# Altium schematic sheet Power.SchDoc
size A; SheetNumber: roneV11-Power; SheetTotal: 6
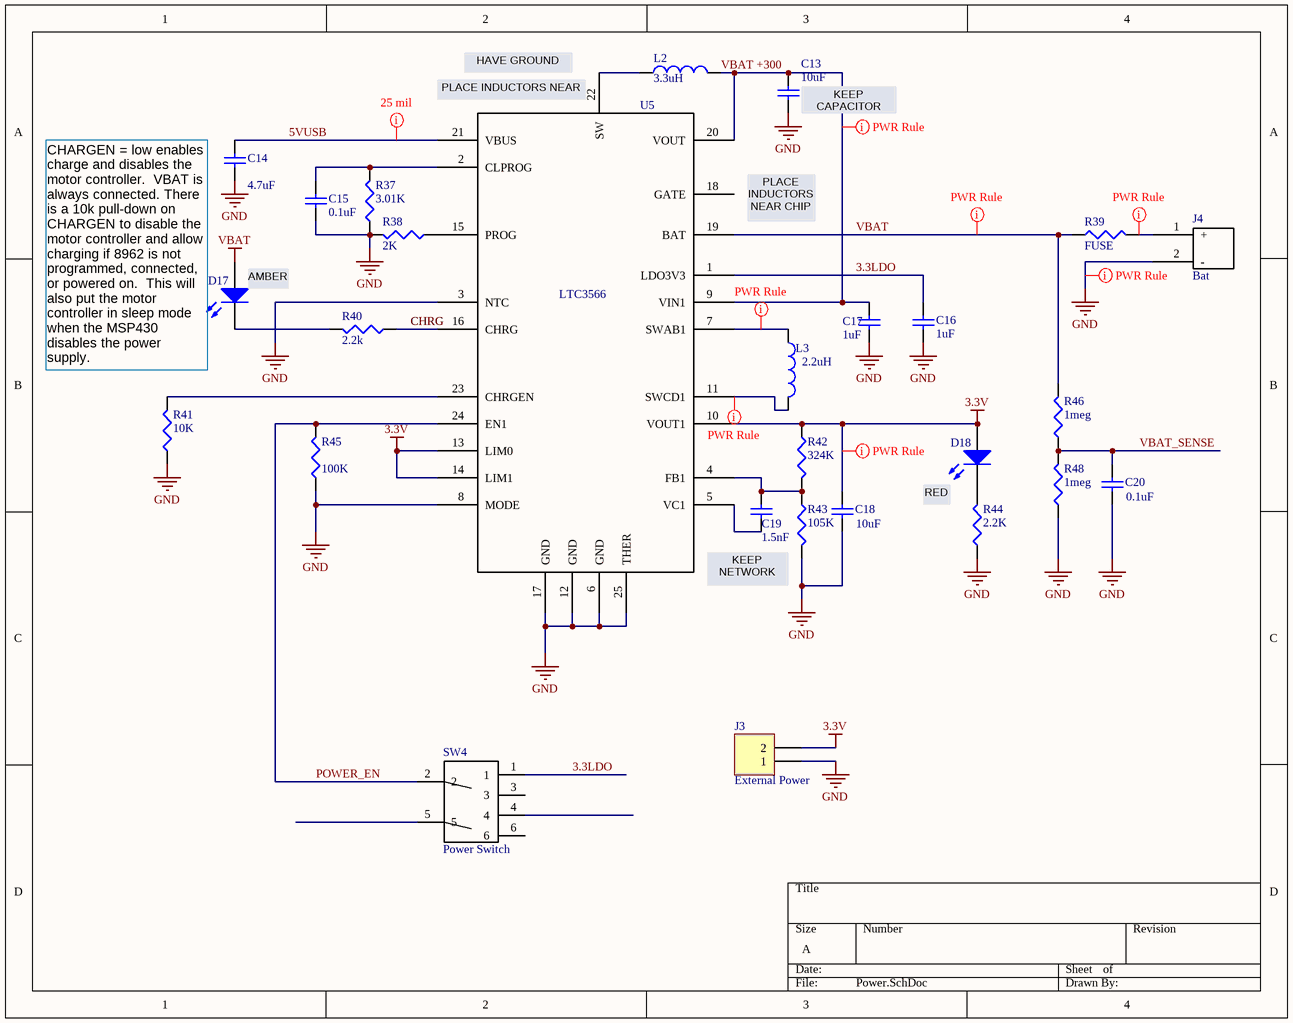
[diagram p0: Power.SchDoc]

## Parts
C13  value 10uF  [CAPC1608L]  (hidden comment: Cap)
C14  value 4.7uF  [CAPC1005L]  (hidden comment: Cap Semi)
C15  value 0.1uF  [CAPC1005L]  (hidden comment: Cap)
C16  value 1uF  [CAPC1608L]  (hidden comment: Cap)
C17  value 1uF  [CAPC1608L]  (hidden comment: Cap)
C18  value 10uF  [CAPC1608L]  (hidden comment: Cap)
C19  value 1.5nF  [CAPC1005L]  (hidden comment: Cap)
C20  value 0.1uF  [CAPC1608L]  (hidden comment: Cap)
D17  Charge  [2029]  (value not drawn)
D18  Power  [2029]  (value not drawn)
J3  External Power  [HDR1X2]
J4  Bat  [BatteryConnJST]
L2  3.3uH  [IndPow]
L3  2.2uH  [IndPow]
R37  value 3.01K  [J1-0603]  (hidden comment: Res3)
R38  value 2K  [J1-0603]  (hidden comment: Res3)
R39  value FUSE  [RESC3225L]  (hidden comment: Res3)
R40  value 2.2k  [J1-0603]  (hidden comment: Res3)
R41  value 10K  [J1-0603]  (hidden comment: Res3)
R42  value 324K  [J1-0603]  (hidden comment: Res3)
R43  value 105K  [J1-0603]  (hidden comment: Res3)
R44  value 2.2K  [J1-0603]  (hidden comment: Res3)
R45  value 100K  [J1-0603]  (hidden comment: Res3)
R46  value 1meg  [J1-0603]  (hidden comment: Res3)
R48  value 1meg  [J1-0603]  (hidden comment: Res3)
SW4  Power Switch  [DPDTSwitch]
U5  LTC3566  [QFN-24]

## Nets
3.3V: C18.2 D18.1(A) J3.2 R42.1 U5.10(VOUT1) U5.13(LIM0) U5.14(LIM1)
GND: C13.1 C14.1 C15.1 C16.2 C17.2 C18.1 C20.1 J3.1 J4.2(-) R37.1 R38.2 R41.1 R43.2 R44.1 R45.1 R48.1 U5.3(NTC) U5.6(GND) U5.8(MODE) U5.12(GND) U5.17(GND) U5.25(THER)
VBAT: D17.1(A) R39.1 R46.2 U5.19(BAT)
3.3LDO: C16.1 SW4.1 U5.1(LDO3V3)
5VUSB: C14.2 U5.21(VBUS)
CHRG: R40.1 U5.16(CHRG)
POWER_EN: R45.2 SW4.2 U5.24(EN1)
VBAT +300: C13.2 C17.1 L2.2 U5.9(VIN1) U5.20(VOUT)
VBAT_SENSE: C20.2 R46.1 R48.2
NetC15_2: C15.2 R37.2 U5.2(CLPROG)
NetC19_1: C19.1 R42.2 R43.1 U5.4(FB1)
NetC19_2: C19.2 U5.5(VC1)
NetD17_2: D17.2(K) R40.2
NetD18_2: D18.2(K) R44.2
NetJ4_1: J4.1(+) R39.2
NetL2_1: L2.1 U5.22(SW)
NetL3_1: L3.1 U5.7(SWAB1)
NetL3_2: L3.2 U5.11(SWCD1)
NetR38_1: R38.1 U5.15(PROG)
NetR41_2: R41.2 U5.23(CHRGEN)

Not connected (* = marked no-connect by the designer): SW4 3 4 5 6; U5 18(GATE)

## Layout directives
rule Width Constraint [Pref Width = 8mil    Min Width = 8mil    Max Width = 25mil]: 5VUSB
rule Width Constraint [Pref Width = 25mil    Min Width = 10mil    Max Width = 50mil]: 3.3V, GND, NetJ4_1, NetL3_1, NetL3_2, VBAT, VBAT +300

## Notes on the sheet
- (near U5) PLACE INDUCTORS NEAR CHIP
- (near U5) HAVE GROUND PLANE
- (near C13) KEEP CAPACITOR CLOSE TO CHIP
- PLACE INDUCTORS NEAR CHIP
- (near D17) AMBER
- CHARGEN = low enables charge and disables the motor controller.  VBAT is always connected. There is a 10k pull-down on CHARGEN to disable the motor controller and allow charging if 8962 is not programmed, connected, or powered on.  This will also put the motor controller in sleep mode when the MSP430 disables the power supply.
- CHRG
- RED
- KEEP NETWORK CLOSE TO CHIP

## Library data of the parts
C13 C15-C20 = Cap: Capacitor; Published: 8-Jun-2000; LatestRevisionDate: 17-Jul-2002; LatestRevisionNote: Re-released for DXP Platform.; PackageReference: RAD-0.3; Publisher: Altium Limited
C14 = Cap Semi: Capacitor (Semiconductor SIM Model); Published: 8-Jun-2000; LatestRevisionDate: 29-May-2009; LatestRevisionNote: IPC-7351 Footprint Added.; PackageReference: C1206; Publisher: Altium Limited; PackageDescription: Chip Capacitor
D17 D18 = LED2: Typical RED, GREEN, YELLOW, AMBER GaAs LED; Published: 8-Jun-2000; LatestRevisionDate: 17-Jul-2002; LatestRevisionNote: Re-released for DXP Platform.; PackageVersion: Feb-2002; PackageReference: 3.2X1.6X1.1; Publisher: Altium Limited
J3 = Header 2: Header, 2-Pin; LatestRevisionDate: 17-Jul-2002; LatestRevisionNote: Re-released for DXP Platform.; Publisher: Altium Limited
J4 = BatteryConnJST
L2 L3 = Inductor
  L2: Value: 3.3uH
  L3: Value: 2.2uH
R37-R46 R48 = Res3: Resistor; Published: 8-Jun-2000; LatestRevisionDate: 29-May-2009; LatestRevisionNote: IPC-7351 Footprint Added.; PackageReference: J1-0603; Publisher: Altium Limited; PackageDescription: Chip Resistor
SW4 = DPDTSwitch